# Altium project go_kart_control.PrjPcb
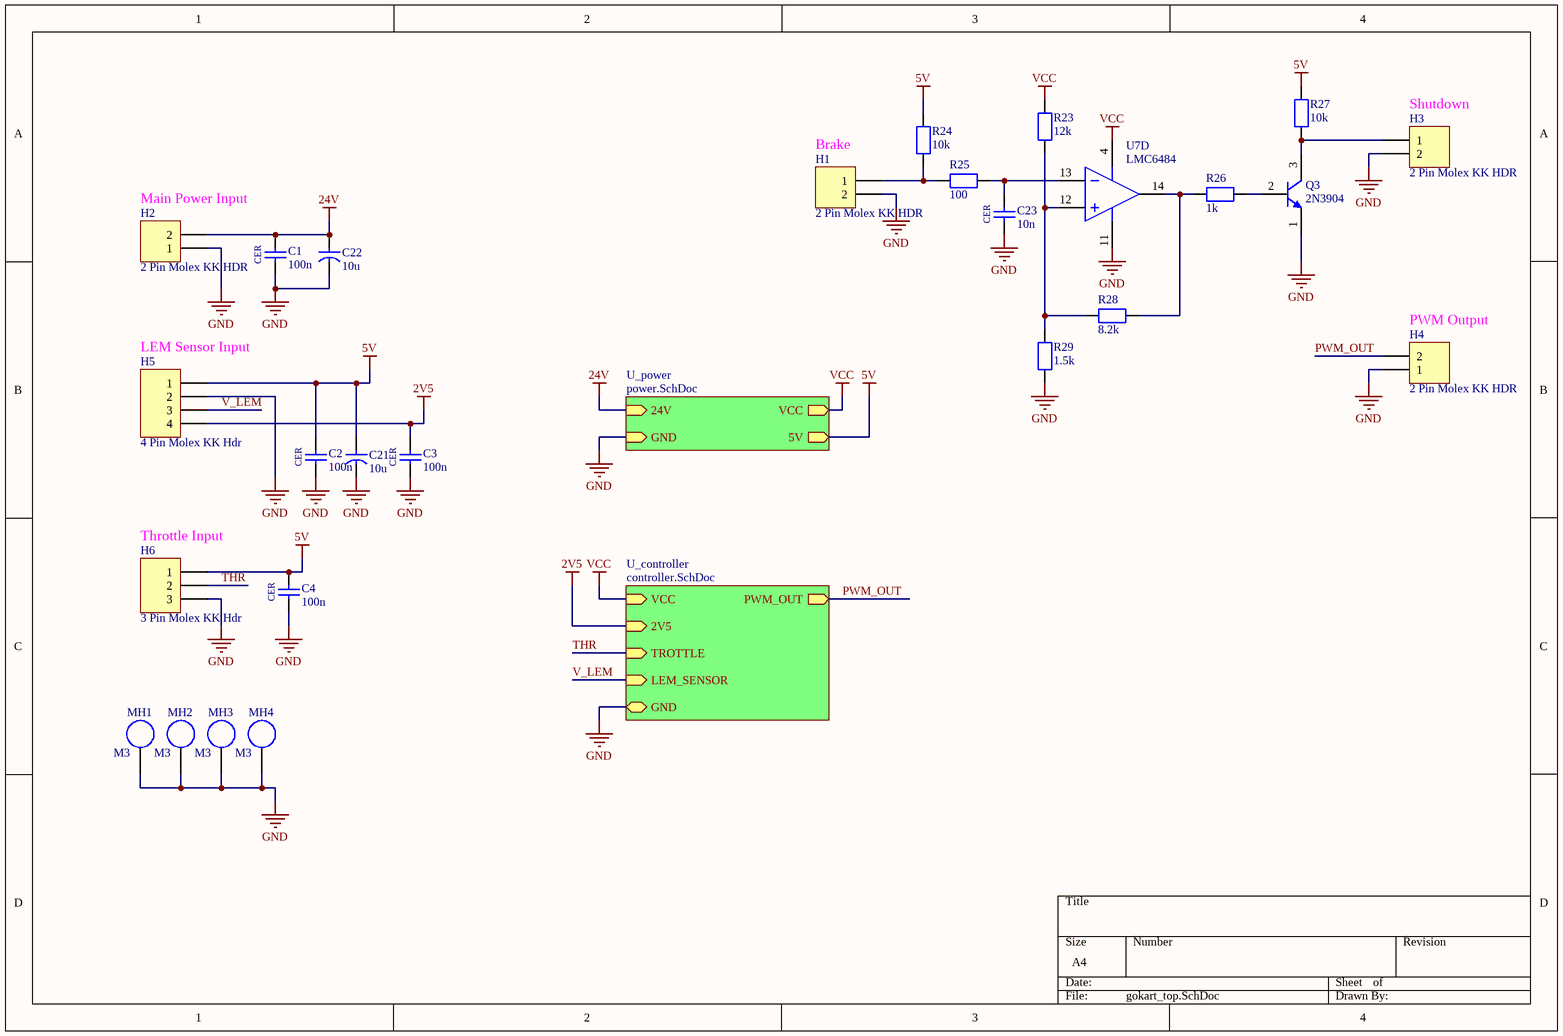
[diagram p0: gokart_top.SchDoc]
3 sheets, 70 parts. Net scope: strictly hierarchical (ports join the sheet entries above them; power ports are local).
Board file: gokart_pcb.PcbDoc
Sheets:
  gokart_top.SchDoc
    U_power = power.SchDoc
    U_controller = controller.SchDoc

## Sheet gokart_top.SchDoc: Go Kart Control Board
size A4; Revision: 0.1

### Parts
C1  100n  [CAP_CER_2.50]
C2  100n  [CAP_CER_2.50]
C3  100n  [CAP_CER_2.50]
C4  100n  [CAP_CER_2.50]
C21  10u  [CAP_ELEC_2.50]
C22  10u  [CAP_ELEC_2.50]
C23  10n  [CAP_CER_2.50]
H1  2 Pin Molex KK HDR  [MOLEX_KK_2_HDR]
H2  2 Pin Molex KK HDR  [MOLEX_KK_2_HDR]
H3  2 Pin Molex KK HDR  [MOLEX_KK_2_HDR]
H4  2 Pin Molex KK HDR  [MOLEX_KK_2_HDR]
H5  4 Pin Molex KK Hdr  [MOLEX_KK_4_HDR]
H6  3 Pin Molex KK Hdr  [MOLEX_KK_3_HDR]
MH1  M3  [M3-Mounting-Hole]
MH2  M3  [M3-Mounting-Hole]
MH3  M3  [M3-Mounting-Hole]
MH4  M3  [M3-Mounting-Hole]
Q3  2N3904  [ONSC-TO-92-3-29-04_AD]
R23  12k  [RESISTOR_THROUGH_HOLE]
R24  10k  [RESISTOR_THROUGH_HOLE]
R25  100  [RESISTOR_THROUGH_HOLE]
R26  1k  [RESISTOR_THROUGH_HOLE]
R27  10k  [RESISTOR_THROUGH_HOLE]
R28  8.2k  [RESISTOR_THROUGH_HOLE]
R29  1.5k  [RESISTOR_THROUGH_HOLE]
U7  LMC6484  [TI-J14]  (part D of 4)

### Sub-sheets
U_controller = controller.SchDoc: TROTTLE (in), LEM_SENSOR (in), VCC (in), 2V5 (in), PWM_OUT (out), GND (bidir)
U_power = power.SchDoc: 24V (in), GND (in), VCC (out), 5V (out)

### Nets
2V5: C3.2 H5.4 ; sheet U_controller/2V5
5V: C2.2 C4.2 C21.1 H5.1 H6.1 R24.2 R27.2 ; sheet U_power/5V
24V: C1.2 C22.1 H2.2 ; sheet U_power/24V
GND: C1.1 C2.1 C3.1 C4.1 C21.2 C22.2 C23.1 H1.2 H2.1 H3.2 H4.1 H5.2 H6.3 MH1.1 MH2.1 MH3.1 MH4.1 Q3.1(E) R29.1 U7.11(VCC-) ; sheet U_power/GND, sheet U_controller/GND
VCC: R23.2 U7.4(VCC+) ; sheet U_power/VCC, sheet U_controller/VCC  [project net 15V]
PWM_OUT: H4.2 ; sheet U_controller/PWM_OUT
THR: H6.2 ; sheet U_controller/TROTTLE
V_LEM: H5.3 ; sheet U_controller/LEM_SENSOR
NetC23_2: C23.2 R25.2 U7.13(IN4-)
NetH1_1: H1.1 R24.1 R25.1
NetH3_1: H3.1 Q3.3(C) R27.1
NetQ3_2: Q3.2(B) R26.1
NetR23_1: R23.1 R28.1 R29.2 U7.12(IN4+)
NetR26_2: R26.2 R28.2 U7.14(OUT4)

### Notes on the sheet
- (near H3) Shutdown
- (near H1) Brake
- Main Power Input
- (near H5) LEM Sensor Input
- (near H4) PWM Output
- (near H6) Throttle Input
- (in symbol CAP_CER) CER

### Library data of the parts
C1-C4 C23 = CAP_CER: Value: F
C21 = CAP_ELEC: Value: F
C22 = CAP_ELEC: Value: 10u
H1-H4 = JA_MOLEX_KK_2POS: CONN HEADER 2POS 2.54mm VERT_Thru Hole; Supplier 1: Farnell; Supplier Part Number 1: 1462926; Supplier: ECE Dept; Storage Location: ECE Dept Store; Value: 2 Pin Molex KK HDR
H5 = JA_MOLEX_KK_4POS: CONN HEADER 4POS 2.54mm VERT_Thru Hole; Manufacturer: Molex; Manufacturer PN: 22-23-2041; Supplier Part Number 1: 9731164; Supplier: ECE Dept; Supplier 1: Farnell; Storage Location: ECE Dept Store; Value: 4 Pin Molex KK Hdr
H6 = JA_MOLEX_KK_3POS: CONN HEADER 3POS 2.54mm VERT_Thru Hole; Manufacturer: Molex; Manufacturer PN: 22-23-2031; Supplier Part Number 1: 9731156; Supplier: ECE Dept; Supplier 1: Farnell; Storage Location: ECE Dept Store; Value: 3 Pin Molex KK Hdr
MH1-MH4 = M3-Mounting-Hole
R23-R29 = Resistor: Value: k
Q3 = 2N3904: ComponentLink1Description: Manufacturer URL; ComponentLink1URL: http://www.onsemi.com/; ComponentLink2Description: Datasheet; ComponentLink2URL: http://www.onsemi.com/pub_link/Collateral/BC549B-D.PDF; ComponentLink3Description: Package Specification; ComponentLink3URL: http://www.onsemi.com/pub_link/Collateral/BC549B-D.PDF
U7 = LMC6484: ComponentLink1Description: Manufacturer URL; ComponentLink1URL: http://www.ti.com/; ComponentLink2Description: Datasheet; ComponentLink2URL: http://www.ti.com/lit/ds/symlink/tl064m.pdf; ComponentLink3Description: Package Specification; ComponentLink3URL: http://www.ti.com/litv/pdf/mcer002d

## Sheet power.SchDoc
size A4
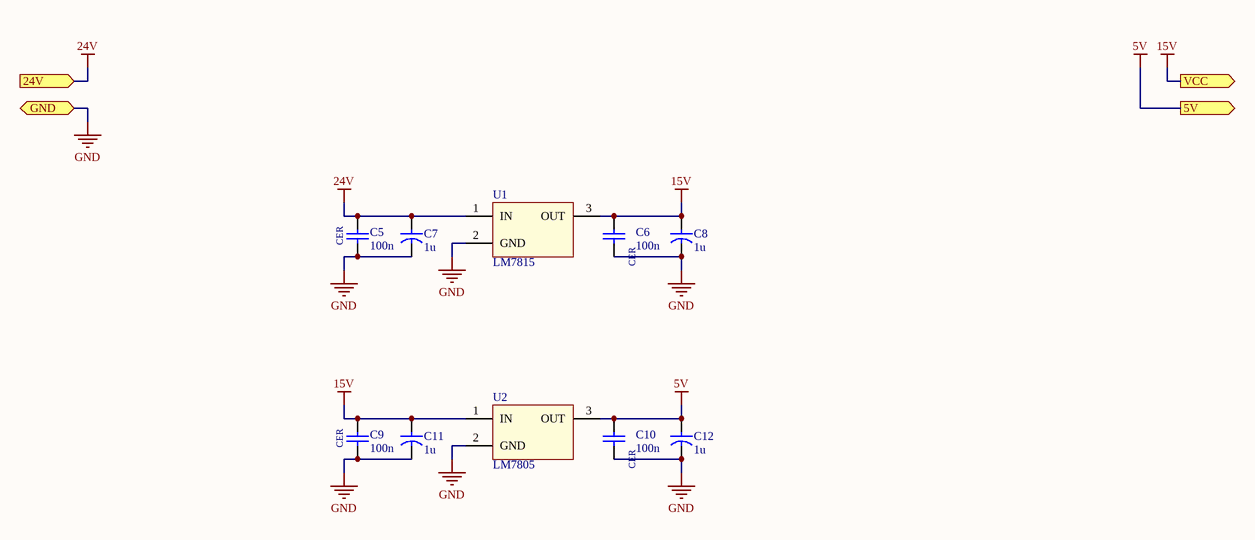
[diagram p1: power.SchDoc]

### Parts
C5  100n  [CAP_CER_2.50]
C6  100n  [CAP_CER_2.50]
C7  1u  [CAP_ELEC_2.50]
C8  1u  [CAP_ELEC_2.50]
C9  100n  [CAP_CER_2.50]
C10  100n  [CAP_CER_2.50]
C11  1u  [CAP_ELEC_2.50]
C12  1u  [CAP_ELEC_2.50]
U1  LM7815  [ONSC-TO-220-3-221A-09]
U2  LM7805  [ONSC-TO-220-3-221A-09]

### Ports
5V (out), 24V (in), GND (bidir), VCC (out)

### Nets
5V: C10.2 C12.1 U2.3(OUT) ; port 5V
15V: C6.2 C8.1 C9.2 C11.1 U1.3(OUT) U2.1(IN) ; port VCC
24V: C5.2 C7.1 U1.1(IN) ; port 24V
GND: C5.1 C6.1 C7.2 C8.2 C9.1 C10.1 C11.2 C12.2 U1.2(GND) U2.2(GND) ; port GND

### Notes on the sheet
- (in symbol CAP_CER) CER

### Library data of the parts
C5 C6 C9 C10 = CAP_CER: Value: F
C7 C8 C11 C12 = CAP_ELEC: Value: F
U1 = LM7815: ComponentLink1Description: Manufacturer URL; ComponentLink1URL: http://www.onsemi.com/; ComponentLink2Description: Datasheet; ComponentLink2URL: http://www.onsemi.com/pub_link/Collateral/NTD5862N-D.PDF; ComponentLink3Description: Package Specification; ComponentLink3URL: http://www.onsemi.com/pub_link/Collateral/221A-09.PDF
U2 = LM7805: ComponentLink1Description: Manufacturer URL; ComponentLink1URL: http://www.onsemi.com/; ComponentLink2Description: Datasheet; ComponentLink2URL: http://www.onsemi.com/pub_link/Collateral/NTD5862N-D.PDF; ComponentLink3Description: Package Specification; ComponentLink3URL: http://www.onsemi.com/pub_link/Collateral/221A-09.PDF

## Sheet controller.SchDoc
size A4
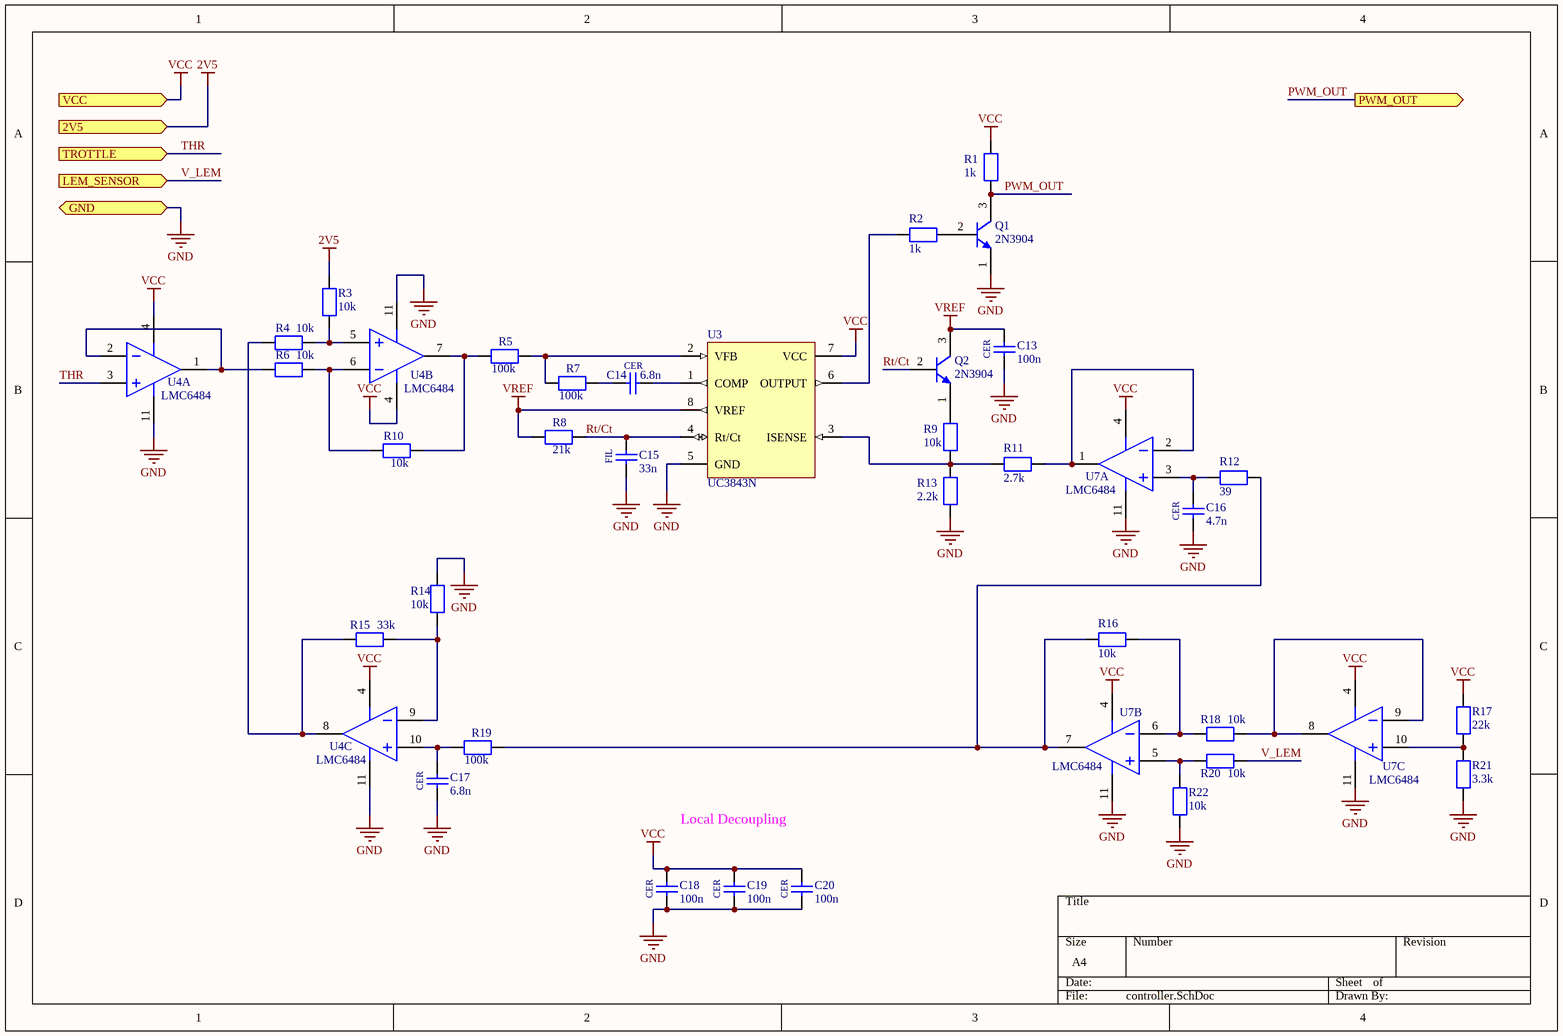
[diagram p2: controller.SchDoc]

### Parts
C13  100n  [CAP_CER_2.50]
C14  6.8n  [CAP_CER_2.50]
C15  33n  [CAP_FILM_10.0]
C16  4.7n  [CAP_CER_2.50]
C17  6.8n  [CAP_CER_2.50]
C18  100n  [CAP_CER_2.50]
C19  100n  [CAP_CER_2.50]
C20  100n  [CAP_CER_2.50]
Q1  2N3904  [ONSC-TO-92-3-29-04_AD]
Q2  2N3904  [ONSC-TO-92-3-29-04_AD]
R1  1k  [RESISTOR_THROUGH_HOLE]
R2  1k  [RESISTOR_THROUGH_HOLE]
R3  10k  [RESISTOR_THROUGH_HOLE]
R4  10k  [RESISTOR_THROUGH_HOLE]
R5  100k  [RESISTOR_THROUGH_HOLE]
R6  10k  [RESISTOR_THROUGH_HOLE]
R7  100k  [RESISTOR_THROUGH_HOLE]
R8  21k  [RESISTOR_THROUGH_HOLE]
R9  10k  [RESISTOR_THROUGH_HOLE]
R10  10k  [RESISTOR_THROUGH_HOLE]
R11  2.7k  [RESISTOR_THROUGH_HOLE]
R12  39  [RESISTOR_THROUGH_HOLE]
R13  2.2k  [RESISTOR_THROUGH_HOLE]
R14  10k  [RESISTOR_THROUGH_HOLE]
R15  33k  [RESISTOR_THROUGH_HOLE]
R16  10k  [RESISTOR_THROUGH_HOLE]
R17  22k  [RESISTOR_THROUGH_HOLE]
R18  10k  [RESISTOR_THROUGH_HOLE]
R19  100k  [RESISTOR_THROUGH_HOLE]
R20  10k  [RESISTOR_THROUGH_HOLE]
R21  3.3k  [RESISTOR_THROUGH_HOLE]
R22  10k  [RESISTOR_THROUGH_HOLE]
U3  UC3843N  [UC3843N]
U4  LMC6484  [TI-J14]  (parts A,B,C of 4)
U7  LMC6484  [TI-J14]  (parts A,B,C of 4)

### Ports
2V5 (in), GND (bidir), LEM_SENSOR (in), PWM_OUT (out), TROTTLE (in), VCC (in)

### Nets
2V5: R3.1 ; port 2V5
GND: C13.1 C15.1 C16.1 C17.1 C18.1 C19.1 C20.1 Q1.1(E) R13.2 R14.1 R21.1 R22.1 U3.5(GND) U4.11(VCC-) U7.11(VCC-) ; port GND
VCC: C18.2 C19.2 C20.2 R1.1 R17.2 U3.7(VCC) U4.4(VCC+) U7.4(VCC+) ; port VCC  [project net 15V]
VREF: C13.2 Q2.3(C) R8.1 U3.8(VREF)
PWM_OUT: Q1.3(C) R1.2 ; port PWM_OUT
Rt/Ct: C15.2 Q2.2(B) R8.2 U3.4(Rt/Ct)
THR: U4.3(IN1+) ; port TROTTLE
V_LEM: R20.2 ; port LEM_SENSOR
NetC14_1: C14.1 R7.2
NetC14_2: C14.2 U3.1(COMP)
NetC16_2: C16.2 R12.1 U7.3(IN1+)
NetC17_2: C17.2 R19.2 U4.10(IN3+)
NetQ1_2: Q1.2(B) R2.2
NetQ2_1: Q2.1(E) R9.1
NetR2_1: R2.1 U3.6(OUTPUT)
NetR3_2: R3.2 R4.2 U4.5(IN2+)
NetR4_1: R4.1 R15.1 U4.8(OUT3)
NetR5_1: R5.1 R10.1 U4.7(OUT2)
NetR5_2: R5.2 R7.1 U3.2(VFB)
NetR6_1: R6.1 R10.2 U4.6(IN2-)
NetR6_2: R6.2 U4.1(OUT1) U4.2(IN1-)
NetR9_2: R9.2 R11.1 R13.1 U3.3(ISENSE)
NetR11_2: R11.2 U7.1(OUT1) U7.2(IN1-)
NetR12_2: R12.2 R16.1 R19.1 U7.7(OUT2)
NetR14_2: R14.2 R15.2 U4.9(IN3-)
NetR16_2: R16.2 R18.1 U7.6(IN2-)
NetR17_1: R17.1 R21.2 U7.10(IN3+)
NetR18_2: R18.2 U7.8(OUT3) U7.9(IN3-)
NetR20_1: R20.1 R22.2 U7.5(IN2+)

### Notes on the sheet
- Local Decoupling
- (in symbol CAP_CER) CER
- (in symbol CAP_FILM) FIL

### Library data of the parts
C13 C14 C16-C20 = CAP_CER: Value: F
C15 = CAP_FILM: Value: F
R1-R22 = Resistor: Value: k
U3 = UC3843N: PWM Controller with Current Control, 100 % Duty Cycle, 0 to +70 degC, 8-pin PDIP (P), Green (RoHS & no Sb/Br); Manufacturer: Texas Instruments; Duty Cycle(Max)(%): 100; Frequency(Max)(kHz): 450; Rating: Catalog; Regulated Outputs(#): 1; Topology: Boost, Buck, Flyback, Forward; UVLO Thresholds On/Off(V): 8.4/7.6; DatasheetVersion: SLUS223C; PackageVersion: revE, Apr-2010; PackageReference: P8; PackageDescription: 8-Pin Plastic Dual-In-Line Package, Row Spacing 7.62 mm, Pitch 2.54 mm; Supplier 1: Digi-Key; Supplier Part Number 1: 296-11288-5-ND; Supplier 2: Farnell; Supplier Part Number 2: 2164381; Supplier 3: Newark; Supplier Part Number 3: 74K4014; Supplier 4: Mouser; Supplier Part Number 4: 595-UC3843N; Control Method: Current; Eco-Plan: Green (RoHS & no Sb/Br); SubFamily: PWM Controller; Mounting Technology: Through Hole; PartNumber: UC3843N; Code_JEDEC: MS-001-BA; ComponentLink1Description: Datasheet; ComponentLink1URL: http://www.ti.com/general/docs/lit/getliterature.tsp?genericPartNumber=UC3843&fileType=pdf
Q1 Q2 = 2N3904: ComponentLink1Description: Manufacturer URL; ComponentLink1URL: http://www.onsemi.com/; ComponentLink2Description: Datasheet; ComponentLink2URL: http://www.onsemi.com/pub_link/Collateral/BC549B-D.PDF; ComponentLink3Description: Package Specification; ComponentLink3URL: http://www.onsemi.com/pub_link/Collateral/BC549B-D.PDF
U4 U7 = LMC6484: ComponentLink1Description: Manufacturer URL; ComponentLink1URL: http://www.ti.com/; ComponentLink2Description: Datasheet; ComponentLink2URL: http://www.ti.com/lit/ds/symlink/tl064m.pdf; ComponentLink3Description: Package Specification; ComponentLink3URL: http://www.ti.com/litv/pdf/mcer002d

## Nets that join several sheets
2V5: gokart_top (C3.2 H5.4), controller (R3.1)
5V: gokart_top (7 pins), power (C10.2 C12.1 U2.3)
15V: gokart_top (R23.2 U7.4), power (6 pins), controller (8 pins)
24V: gokart_top (C1.2 C22.1 H2.2), power (C5.2 C7.1 U1.1)
GND: gokart_top (20 pins), power (10 pins), controller (15 pins)
PWM_OUT: gokart_top (H4.2), controller (Q1.3 R1.2)
THR: gokart_top (H6.2), controller (U4.3)
V_LEM: gokart_top (H5.3), controller (R20.2)